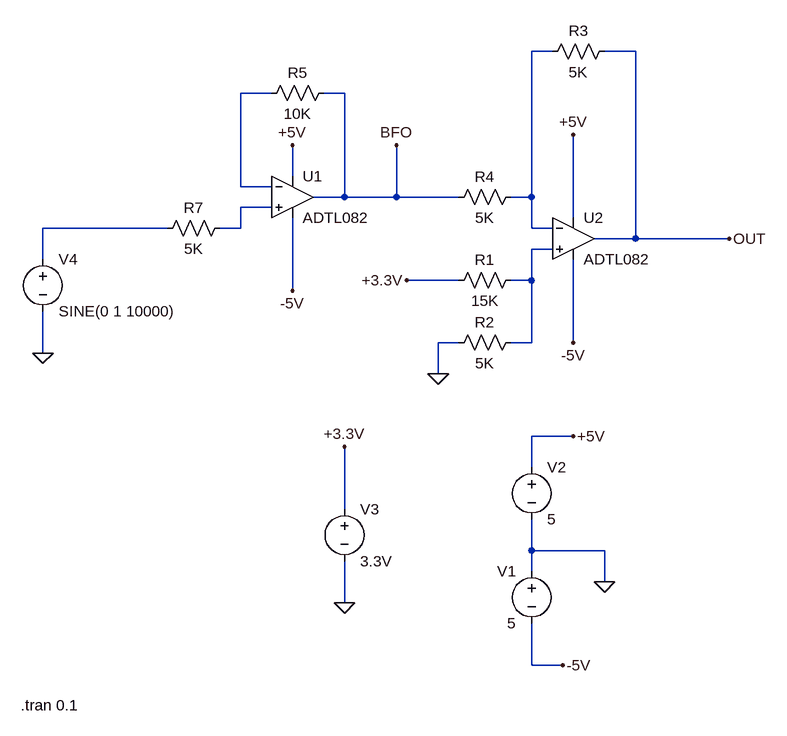
[diagram p0: schematic DSO_LTspice.asc]
DSO_LTspice.asc, the LTspice schematic file:
Version 4
SHEET 1 932 912
WIRE 432 -112 400 -112
WIRE 560 -112 512 -112
WIRE 0 -48 -48 -48
WIRE 112 -48 80 -48
WIRE 32 80 32 32
WIRE -48 96 -48 -48
WIRE 0 96 -48 96
WIRE 112 112 112 -48
WIRE 112 112 64 112
WIRE 192 112 192 32
WIRE 192 112 112 112
WIRE 288 112 192 112
WIRE 400 112 400 -112
WIRE 400 112 368 112
WIRE 0 128 -48 128
WIRE 464 144 464 16
WIRE -160 160 -352 160
WIRE -48 160 -48 128
WIRE -48 160 -80 160
WIRE 400 160 400 112
WIRE 432 160 400 160
WIRE 560 176 560 -112
WIRE 560 176 496 176
WIRE 704 176 560 176
WIRE 432 192 400 192
WIRE -352 208 -352 160
WIRE 288 240 208 240
WIRE 400 240 400 192
WIRE 400 240 368 240
WIRE 32 256 32 144
WIRE 288 336 256 336
WIRE 400 336 400 240
WIRE 400 336 368 336
WIRE 464 336 464 208
WIRE -352 352 -352 288
WIRE 256 384 256 336
WIRE 464 480 400 480
WIRE 400 528 400 480
WIRE 112 592 112 496
WIRE 400 656 400 608
WIRE 512 656 400 656
WIRE 400 688 400 656
WIRE 512 704 512 656
WIRE 112 736 112 672
WIRE 400 832 400 768
WIRE 448 832 400 832
FLAG 256 384 0
FLAG 512 704 0
FLAG 448 832 -5V
FLAG 464 480 +5V
FLAG 464 336 -5V
FLAG 464 16 +5V
FLAG 704 176 OUT
FLAG 112 736 0
FLAG 112 496 +3.3V
FLAG 208 240 +3.3V
FLAG -352 352 0
FLAG 32 32 +5V
FLAG 32 256 -5V
FLAG 192 32 BFO
SYMBOL Opamps\\ADTL082 32 48 R0
SYMATTR InstName U1
SYMBOL Opamps\\ADTL082 464 112 R0
SYMATTR InstName U2
SYMBOL res 384 224 R90
WINDOW 0 0 56 VBottom 2
WINDOW 3 32 56 VTop 2
SYMATTR InstName R1
SYMATTR Value 15K
SYMBOL res 384 320 R90
WINDOW 0 0 56 VBottom 2
WINDOW 3 32 56 VTop 2
SYMATTR InstName R2
SYMATTR Value 5K
SYMBOL res 528 -128 R90
WINDOW 0 0 56 VBottom 2
WINDOW 3 32 56 VTop 2
SYMATTR InstName R3
SYMATTR Value 5K
SYMBOL res 384 96 R90
WINDOW 0 0 56 VBottom 2
WINDOW 3 32 56 VTop 2
SYMATTR InstName R4
SYMATTR Value 5K
SYMBOL voltage 400 672 M0
WINDOW 123 0 0 Left 0
WINDOW 39 0 0 Left 0
SYMATTR InstName V1
SYMATTR Value 5
SYMBOL voltage 400 512 R0
WINDOW 123 0 0 Left 0
WINDOW 39 0 0 Left 0
SYMATTR InstName V2
SYMATTR Value 5
SYMBOL voltage 112 576 R0
WINDOW 123 0 0 Left 0
WINDOW 39 0 0 Left 0
SYMATTR InstName V3
SYMATTR Value 3.3V
SYMBOL res 96 -64 R90
WINDOW 0 0 56 VBottom 2
WINDOW 3 32 56 VTop 2
SYMATTR InstName R5
SYMATTR Value 10K
SYMBOL res -64 144 R90
WINDOW 0 0 56 VBottom 2
WINDOW 3 32 56 VTop 2
SYMATTR InstName R7
SYMATTR Value 5K
SYMBOL voltage -352 192 R0
WINDOW 123 0 0 Left 0
WINDOW 39 0 0 Left 0
SYMATTR InstName V4
SYMATTR Value SINE(0 1 10000)
TEXT -386 894 Left 2 !.tran 0.1

The netlist it stands for:
* DSO_LTspice.asc
XU1 N003 N002 +5V -5V BFO ADTL082  ; pins In+ In- V+ V- OUT
XU2 N005 N001 +5V -5V OUT ADTL082  ; pins In+ In- V+ V- OUT
R1 N005 +3.3V 15K
R2 N005 0 5K
R3 OUT N001 5K
R4 N001 BFO 5K
V1 0 -5V 5
V2 +5V 0 5
V3 +3.3V 0 3.3V
R5 BFO N002 10K
R7 N003 N004 5K
V4 N004 0 SINE(0 1 10000)
.tran 0.1
.lib ADI.lib
.backanno
.end